# EAGLE design opto-relay (EAGLE 8.6.0)
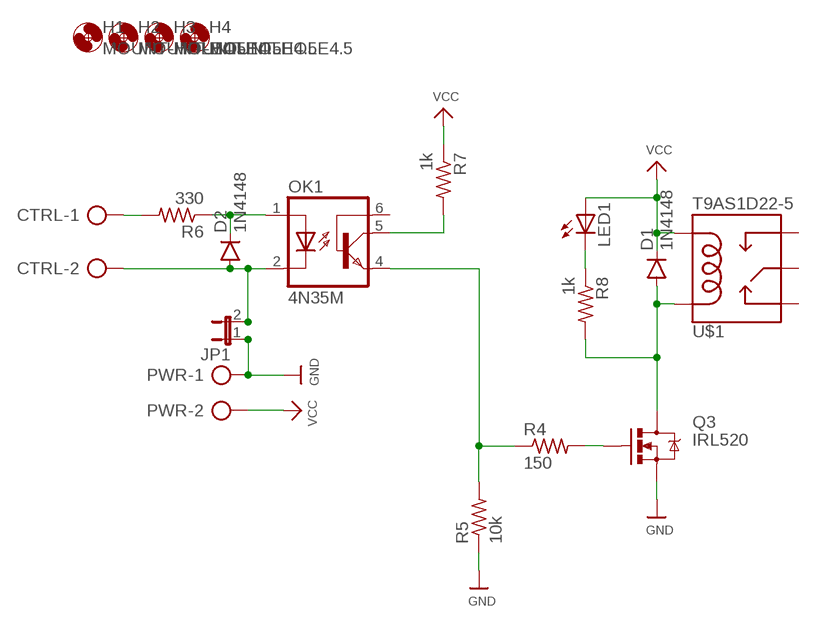
[diagram p0: schematic, sheet 1]

## Parts
CTRL  AK500/2  [AK500/2]
D1  1N4148  DIODE1N4148  [DIODE-1N4148]
D2  1N4148  DIODE1N4148  [DIODE-1N4148]
H1  MOUNT-HOLE4.5  [4,5]
H2  MOUNT-HOLE4.5  [4,5]
H3  MOUNT-HOLE4.5  [4,5]
H4  MOUNT-HOLE4.5  [4,5]
JP1  JP1E  [JP1]
LED1  LED5MM  [LED5MM]
OK1  4N35M  [DIL06]
PWR  AK500/2  [AK500/2]
Q3  IRL520  MOSFET-NCHANNELFQP30N06L  [TO220V]
R4  150  R-US_0207/10  [0207/10]
R5  10k  R-US_0207/10  [0207/10]
R6  330  R-US_0207/10  [0207/10]
R7  1k  R-US_0207/10  [0207/10]
R8  1k  R-US_0207/10  [0207/10]
U$1  T9AS1D22-5  RELAYPTH3  [RELAY-T9A-2]

## Nets
CTRL: OK1.4(EMI) R4.1 R5.2
GND: JP1.1 PWR.1 Q3.3(S) R5.1
N$1: Q3.1(G) R4.2
N$2: LED1.K(C) R8.1
N$3: CTRL.1 R6.2
N$4: CTRL.2 D2.A JP1.2 OK1.2(C)
N$5: D2.C OK1.1(A) R6.1
N$6: D1.A Q3.2(D) R8.2 U$1.COIL1
N$7: OK1.5(COL) R7.2
VCC: D1.C LED1.A PWR.2 R7.1 U$1.COIL2
Unconnected: OK1.6(BAS) U$1.MAIN U$1.NC U$1.NO

## Library data of the parts
CTRL PWR = con-ptr500:AK500/2: CONNECTOR; OC_FARNELL: unknown; OC_NEWARK: unknown
D1 D2 = SparkFun-DiscreteSemi:DIODE: Diode These are standard reverse protection diodes and small signal diodes. SMA package can handle up to about 1A. SOD-323 can handle about 200mA. What the SOD-323 package when ordering, there are some mfgs out there that are 5-pin packages.
H1-H4 = holes:MOUNT-HOLE: MOUNTING HOLE with drill center marker
JP1 = jumper:JP1E: JUMPER
LED1 = led:LED: LED OSRAM: - CHIPLED LG R971, LG N971, LY N971, LG Q971, LY Q971, LO R971, LY R971 LH N974, LH R974 LS Q976, LO Q976, LY Q976 LO Q996 - Hyper CHIPLED LW Q18S LB Q993, LB Q99A, LB R99A - SideLED LS A670, LO A670, LY A670, LG A670, LP A670 LB A673, LV A673, LT A673, LW A673 LH A674 LY A675 LS A676, LA A676, LO A676, LY A676, LW A676 LS A679, LY A679, LG A679 - Hyper Micro SIDELED® LS Y876, LA Y876, LO Y876, LY Y876 LT Y87S - SmartLED LW L88C, LW L88S LB L89C, LB L89S, LG L890 LS L89K, LO L89K, LY L89K LS L896, LA L896, LO L896, LY L896 - TOPLED LS T670, LO T670, LY T670, LG T670, LP T670 LSG T670, LSP T670, LSY T670, LOP T670, LYG T670 LG T671, LOG T671, LSG T671 LB T673, LV T673, LT T673, LW T673 LH T674 LS T676, LA T676, LO T676, LY T676, LB T676, LH T676, LSB T676, LW T676 LB T67C, LV T67C, LT T67C, LS T67K, LO T67K, LY T67K, LW E67C LS E67B, LA E67B, LO E67B, LY E67B, LB E67C, LV E67C, LT E67C LW T67C LS T679, LY T679, LG T679 LS T770, LO T770, LY T770, LG T770, LP T770 LB T773, LV T773, LT T773, LW T773 LH T774 LS E675, LA E675, LY E675, LS T675 LS T776, LA T776, LO T776, LY T776, LB T776 LHGB T686 LT T68C, LB T68C - Hyper Mini TOPLED® LB M676 - Mini TOPLED Santana® LG M470 LS M47K, LO M47K, LY M47K Source: http://www.osram.convergy.de LUXEON: - LUMILED® LXK2-PW12-R00, LXK2-PW12-S00, LXK2-PW14-U00, LXK2-PW14-V00 LXK2-PM12-R00, LXK2-PM12-S00, LXK2-PM14-U00 LXK2-PE12-Q00, LXK2-PE12-R00, LXK2-PE12-S00, LXK2-PE14-T00, LXK2-PE14-U00 LXK2-PB12-K00, LXK2-PB12-L00, LXK2-PB12-M00, LXK2-PB14-N00, LXK2-PB14-P00, LXK2-PB14-Q00 LXK2-PR12-L00, LXK2-PR12-M00, LXK2-PR14-Q00, LXK2-PR14-R00 LXK2-PD12-Q00, LXK2-PD12-R00, LXK2-PD12-S00 LXK2-PH12-R00, LXK2-PH12-S00 LXK2-PL12-P00, LXK2-PL12-Q00, LXK2-PL12-R00 Source: www.luxeon.com KINGBRIGHT: KA-3528ASYC Source: www.kingbright.com
OK1 = optocoupler:4N*?M: General Purpose 6-Pin Phototransistor Optocouplers Source: http://www.fairchildsemi.com/ds/4N/4N35-M.pdf; MPN: 4N35-M; OC_FARNELL: 1021351; OC_NEWARK: 98K9114
Q3 = keves-ng:MOSFET-NCHANNEL: Common NMOSFET Parts MFG P/N Store ID Prod ID FDD8780 TRANS-09984 SI7820DN TRANS-11055 FDS6630A IC-08089 2N7002PW TRANS-11151 FQP30N06L COM-10213 TRANS-10060 BSS123LT1G TRANS-08345 BSS138 TRANS-00830 BS170 2N7000; PROD_ID: TRANS-10060
R4-R8 = rcl:R-US_: RESISTOR, American symbol; SPICEPREFIX: R
U$1 = SparkFun-Electromechanical:RELAY: SPDT relay (COM-00101)

## Board
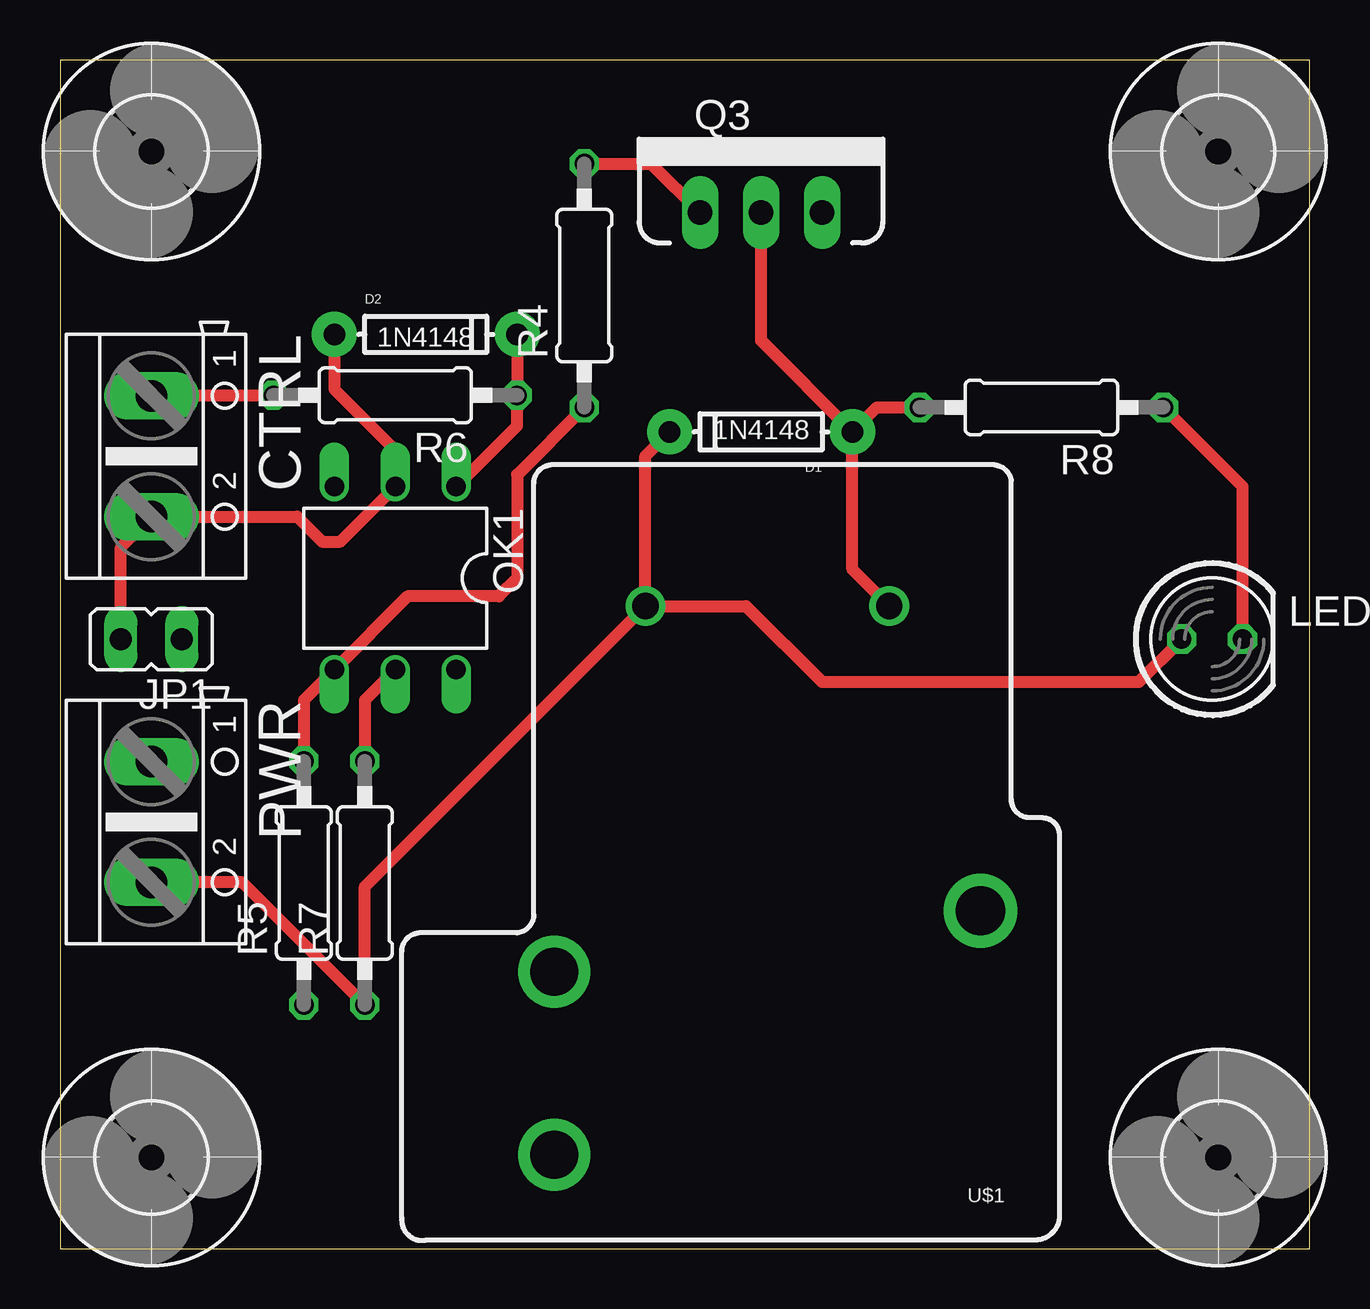
[diagram p1: board, top side]
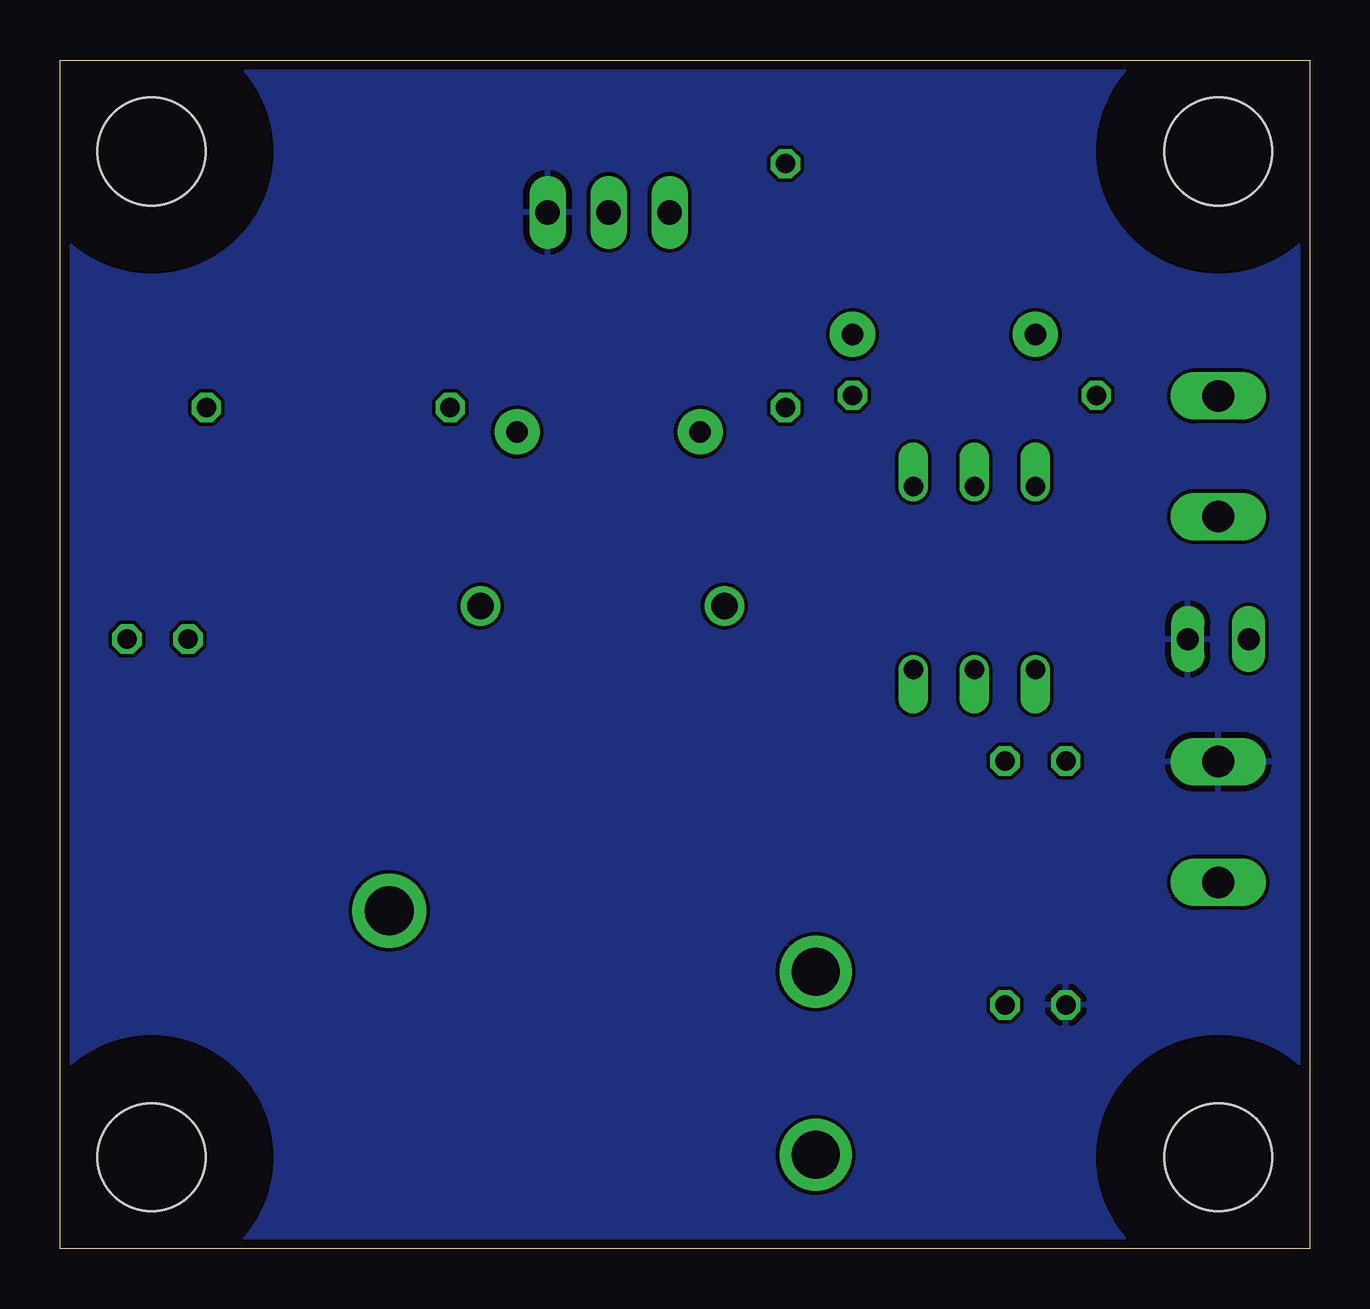
[diagram p2: board, bottom side, seen from below]

Size 52.07 x 49.53 mm. Coordinates in mm from the lower left corner, seen from the top.
Outline: 0,0 52.07,0 52.07,49.53 0,49.53 0,0
Copper layers (1*16): Top 0.0356mm / dielectric 1.5011mm / Bottom 0.0356mm
Design rules "oshpark-2layer-2017-05": minimum track width 6mil, minimum drill 13mil, track to track 6mil, track to pad 6mil, pad to pad 6mil, via to via 6mil, smd to smd 6mil, copper to edge 15mil, drill to drill 6mil, minimum pad ring 7mil, minimum via ring 7mil, stop-mask expansion 2.5mil, vias tented up to drill 0mil, thermal gap 10mil

### Footprints (pad centres in the part's own frame; a part is rotated, then mirrored left to right if it is on the bottom)
AK500/2 = drill 1.321 long: 1 -2.515,0; 2 2.515,0
DIODE-1N4148 = drill 0.9 pad 1.88: A -3.81,0; C 3.81,0
4,5 = hole 4.5: 0,0
JP1 = drill 0.914 long: 1 0,-1.27; 2 0,1.27
LED5MM = drill 0.813 octagon: A -1.27,0; K 1.27,0
DIL06 = drill 0.813 offset: 1 -2.54,-3.81; 2 0,-3.81; 3 2.54,-3.81; 4 2.54,3.81; 5 0,3.81; 6 -2.54,3.81
TO220V = drill 1.016 long: 1 -2.54,0; 2 0,0; 3 2.54,0
0207/10 = drill 0.813 octagon: 1 -5.08,0; 2 5.08,0
RELAY-T9A-2 = drill 1.1: COIL1 -6.61,-10.27; COIL2 3.55,-10.27 | drill 2.057: MAIN -10.41,2.43 | drill 2: NC 7.35,12.6; NO 7.35,4.97

### Placement (x,y rotation side)
CTRL  3.81,33.02 270 top
D1  29.21,34.04 180 top
D2  15.24,38.1 0 top
H1  3.81,3.81 0 top
H2  48.26,45.72 0 top
H3  3.81,45.72 0 top
H4  48.26,3.81 0 top
JP1  3.81,25.4 90 top
LED1  48.01,25.4 0 top
OK1  13.97,27.94 180 top
PWR  3.81,17.78 270 top
Q3  29.21,43.18 0 top
R4  21.84,40.13 90 top
R5  10.16,15.24 90 top
R6  13.97,35.56 180 top
R7  12.7,15.24 90 top
R8  40.89,35.05 180 top
U$1  27.94,16.51 180 top

### Tracks (layer width: path | path; a pad name or v marks a point on that pad's centre or on a via)
CTRL
  Top 0.508: R5.2 10.16,22.86 OK1.4 14.48,27.18 18.29,27.18 19.05,27.94 19.05,32.26 R4.1
GND
  pour Bottom: -3.81,53.34 52.07,53.34 55.88,49.53 55.88,-1.27 50.8,-6.35 1.27,-6.35 -5.08,0 -5.08,50.8 -5.08,52.07
N$1
  Top 0.508: R4.2 24.64,45.21 Q3.1
N$2
  Top 0.508: LED1.K 49.28,31.75 R8.1
N$3
  Top 0.508: CTRL.1 3.83,35.56 R6.2
N$4
  Top 0.508: JP1.2 2.54,29.23 CTRL.2 9.88,30.5 10.92,29.46 11.68,29.46 OK1.2 13.97,33.27 11.43,35.81 D2.A
N$5
  Top 0.508: D2.C R6.1 19.05,34.29 OK1.1
N$6
  Top 0.508: U$1.COIL1 33.02,28.31 D1.A | D1.A 29.21,37.85 Q3.2 | D1.A 34.04,35.05 R8.2
N$7
  Top 0.508: OK1.5 12.7,22.86 R7.2
VCC
  Top 0.508: PWR.2 7.59,15.27 R7.1 12.7,15.09 U$1.COIL2 | U$1.COIL2 24.39,33.03 D1.C | U$1.COIL2 28.59,26.78 31.75,23.62 44.96,23.62 LED1.A